# Altium project Charge-Pump-Shield.PrjPcb
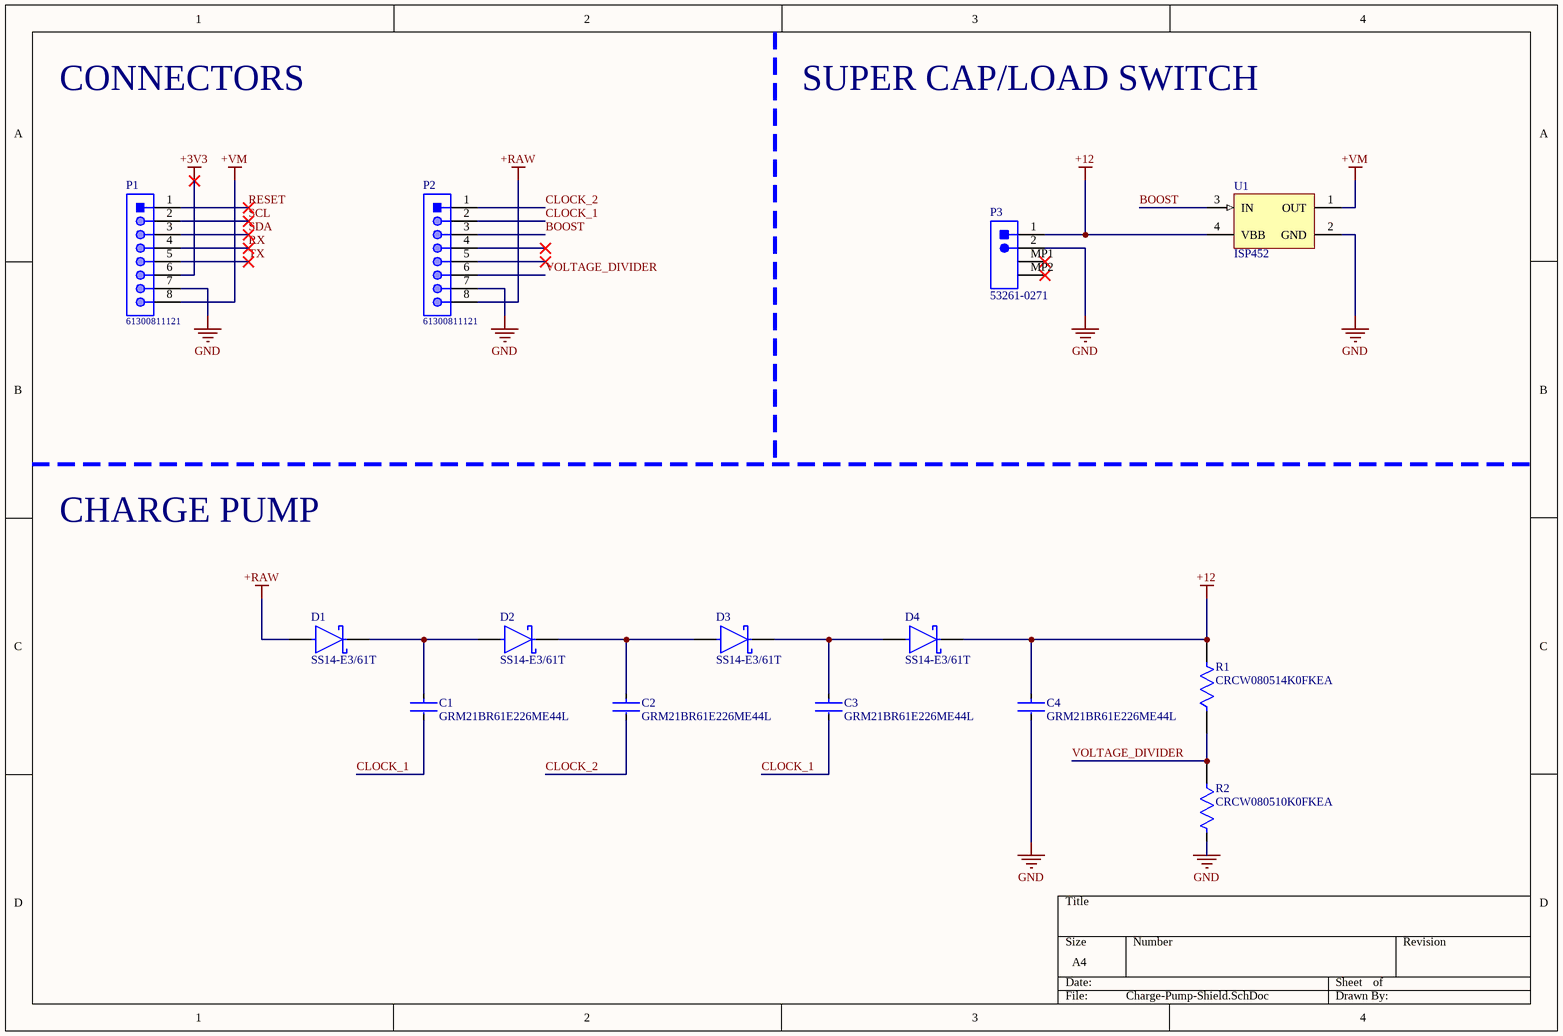
[diagram p0: Charge-Pump-Shield.SchDoc]
1 sheet, 14 parts. Net scope: global (net labels, ports and power ports of the same name join across sheets).
Board file: Charge-Pump-Shield.PcbDoc

## Sheet Charge-Pump-Shield.SchDoc: Charge Pump Shield
size A4; Author: Denil Poudel; SheetNumber: 1; SheetTotal: 1

### Parts
C1  GRM21BR61E226ME44L  [FP-GRM21B-0_2-e0_2_0_7-IPC_B]
C2  GRM21BR61E226ME44L  [FP-GRM21B-0_2-e0_2_0_7-IPC_B]
C3  GRM21BR61E226ME44L  [FP-GRM21B-0_2-e0_2_0_7-IPC_B]
C4  GRM21BR61E226ME44L  [FP-GRM21B-0_2-e0_2_0_7-IPC_B]
D1  SS14-E3/61T  [FP-95400-MFG]
D2  SS14-E3/61T  [FP-95400-MFG]
D3  SS14-E3/61T  [FP-95400-MFG]
D4  SS14-E3/61T  [FP-95400-MFG]
P1  61300811121  [61300811121]
P2  61300811121  [61300811121]
P3  53261-0271  [MOLX-53261-0271_V]
R1  CRCW080514K0FKEA  [FP-CRCW0805-e3-MFG]
R2  CRCW080510K0FKEA  [FP-CRCW0805-e3-IPC_A]
U1  ISP452  [INF-SOT223_L]

### Nets
+3V3: P1.6
+12: C4.1 D4.1(C) P3.1 R1.2 U1.4(VBB)
+RAW: D1.2(A) P2.8
+VM: P1.8 U1.1(OUT)
GND: C4.2 P1.7 P2.7 P3.2 R2.2 U1.2(GND)
BOOST: P2.3 U1.3(IN)
CLOCK_1: C1.2 C3.2 P2.2
CLOCK_2: C2.2 P2.1
RESET: P1.1
RX: P1.4
SCL: P1.2
SDA: P1.3
TX: P1.5
VOLTAGE_DIVIDER: P2.6 R1.1 R2.1
NetC1_1: C1.1 D1.1(C) D2.2(A)
NetC2_1: C2.1 D2.1(C) D3.2(A)
NetC3_1: C3.1 D3.1(C) D4.2(A)

Not connected (* = marked no-connect by the designer): P2 4* 5*; P3 MP1* MP2*

### Notes on the sheet
- CONNECTORS
- SUPER CAP/LOAD SWITCH
- CHARGE PUMP

### Library data of the parts
C1-C4 = CMP-2007-03222-3: Chip Multilayer Ceramic Capacitors for General Purpose, 0805, 22uF, X5R, 15%, 20%, 25V; Case/Package: 0805; Depth: 1.25mm; Resistor Type: Ceramic; Voltage Rating: 25V; Lead Free: Lead Free; Voltage Rating (DC): 25V; Case Code (Metric): 2012; Thickness: 0.057inch; REACH SVHC: No SVHC; Material: Ceramic; Tolerance: 20%; Length: 2mm; Capacitance: 22uF; Case Code (Imperial): 0805; Max Operating Temperature: 85°C; Termination: SMD/SMT; Weight: 0.000335oz; Dielectric: X5R; Packaging: Tape and Reel; Voltage: 25V; Package Quantity: 3000; Height: 1.25mm; Mount: Surface Mount; Width: 1.25mm; Min Operating Temperature: -55°C
D1-D4 = CMP-02539-000035-1: DIODE SCHOTTKY 40V 1A DO214AC; Manufacturer: Vishay; Peak Reverse Current: 0.2mA; Standoff Height: 0mm; Max Junction Temp: +150°C; Max Surge Forward Current: 40A; RoHS: TRUE; Digikey Description: DIODE SCHOTTKY 40V 1A DO214AC; Category: Diode; Device Class L3: Schottky Diodes; Temperature Range High: +150°C; Automotive: No; Temperature: -65°C to +150°C; Device Class L2: Diodes; Forward Current: 1A; Temperature Range Low: -65°C; Footprint Url: http://www.vishay.com/docs/95400/sma.pdf; Octopart: https://octopart.com/ss14-e3%2F61t-vishay-39552847; Package: 95400; Max Repetitive Reverse Voltage: 40V; ComponentLink2Description: Datasheet; ComponentLink2URL: http://www.vishay.com/docs/88746/ss12.pdf; Lead Free: Yes; Height: 2.29mm; Mouser Description: SS14 Series 40 V 1 A Surface Mount Schottky Barrier Rectifier - DO-214AC (SMA); Manufacturer Part Number: SS14-E3/61T; Device Class L1: Discrete Semiconductors
P1 P2 = CMP-1502-01076-1: THT Vertical Pin Header WR-PHD, Pitch 2.54 mm, Single Row, 8 pins; Manufacturer: Wurth Elektronik; Rated Current: 3A; Pin Number: 8; Working Voltage: 250VAC; Gender: Male; Contact Resistance: 20mOhm; Pitch: 2.54mm; Withstanding Voltage: 500VAC; Publisher: WurthElektronik; Operating Temperature: -40to105degC; Orientation: Vertical; Row Number: Single; Part Number: 61300811121; Package Reference: 61300811121; Mounting Technology: THT; Packaging: Bag; Manufacturer URL: http://www.we-online.de; Datasheet URL: https://katalog.we-online.de/em/datasheet/6130xx11121.pdf
P3 = CMP-2000-05633-1: PicoBlade(TM) Header, Right Angle, -40 to 85 degC, 2-Pin SMD, RoHS, Tape and Reel; Current - Max: 1A; Brand: Molex; Voltage Rating: 125V; Number of Positions: 2; Pitch: 1.25mm; Package Version: Rev. H, 11/2014; Factory Pack Quantity: 1000; Datasheet URL: http://www.molex.com/webdocs/datasheets/pdf/en-us/0532610271_PCB_HEADERS.pdf; Datasheet Version: 03/2016; Housing Material: Thermoplastic; RoHS: Details; Product Type: Headers; Number of Rows: 1; Termination Style: SMD; Mounting Technology: SurfaceMount; Number of Positions / Contacts: 2; Package URL: http://www.molex.com/pdm_docs/sd/532610271_sd.pdf; Mounting Angle: Right; Mounting Style: SMD/SMT; Manufacturer: Molex; Product Category: 1.25mmConnectors; Tradename: PicoBlade; Voltage - Max: 125V; Manufacturer URL: http://www.molex.com/; Series: 53261; Package Description: 2-Leads Header, Pitch 1.25 mm, Mated Height 3.4 mm; Package Reference: 53261-0271; Current Rating: 1A; Contact Plating: Tin; Contact Material: PhosphorBronze; Type: Shrouded; Packaging: Reel
R1 = CMP-2001-04956-2: RES Thick Film, 14kΩ, 1%, 0.125W, 100ppm/°C, 0805; Voltage Rating: 150V; Max Power Dissipation: 125mW; Resistance: 14kR; Temperature Coefficient: 100ppm/°C; Radiation Hardening: No; Number of Terminations: 2; Lead Free: Lead Free; Depth: 1.25mm; Height: 0.45mm; Case Code (Imperial): 0805; Packaging: Tape and Reel; Termination: SMD/SMT; Military Standard: Not; Length: 2mm; Working Voltage: 150V; Contact Plating: Tin; Power Rating: 125mW; Case/Package: 0805; Case Code (Metric): 2012; Weight: 0.000194oz; Features: Automotive AEC-Q200; Width: 1.25mm; Package Quantity: 10; Voltage Rating (DC): 150V; Mount: Surface Mount; Tolerance: 1%; Composition: Thick Film; Min Operating Temperature: -55°C; Max Operating Temperature: 155°C; Number of Pins: 2
R2 = CMP-2001-04908-2: RES Thick Film, 10kΩ, 1%, 0.125W, 100ppm/°C, 0805; Resistance: 10kR; Voltage Rating (DC): 150V; Power Rating: 125mW; Weight: 0.000194oz; Package Quantity: 5000; Military Standard: Not; Max Operating Temperature: 155°C; Temperature Coefficient: 100ppm/°C; Contact Plating: Tin; Width: 1.25mm; Height: 0.45mm; Radiation Hardening: No; Tolerance: 1%; Min Operating Temperature: -55°C; Voltage Rating: 150V; Length: 2mm; Depth: 1.25mm; Termination: SMD/SMT; Packaging: Tape and Reel; Case/Package: 0805; Case Code (Metric): 2012; Lead Free: Lead Free; Case Code (Imperial): 0805; Composition: Thick Film
U1 = CMP-1095-00141-1: Smart Power High-Side-Switch for Industrial Applications, 5 to 34 V Operating, -30 to 85 degC, SOT223, Reel, Green; Manufacturer: Infineon; Green: TRUE; IL (nom)min - all channels active: 0.7Â A; Channels: 1; IL (nom)min - one channel active: 0.8Â A; Operating Voltage Range (min): 5 V; Ptot (max): 1.8Â W; toff (max): 150 us; RON (max) @ Tj max: 400 mOhm; ton (max): 100 us; IL (SCp): 1.5Â A; Operating Voltage Range (max): 34 V; RON @ 25 degC: 200 mOhm (max); ComponentLink3Description: Package Specification; Mounting Technology: Surface Mount; ComponentLink2Description: Datasheet; PartNumber: ISP452; Packing: Reel; Load Current (typ): 0.7Â A; PackageDescription: 4-Pin Small Outline Transistor Package, 6.5 x 3.5 mm Body, 2.3 mm Pitch; ComponentLink3URL: http://www.infineon.com/dgdl/SOT223-Package_Overview.pdf?folderId=db3a30431936bc4b0119530470b03c3d&fileId=db3a30431936bc4b0119531d40b93c5c; ComponentLink1Description: Manufacturer URL; ComponentLink1URL: http://www.infineon.com/; ComponentLink2URL: http://www.infineon.com/dgdl/ISP452_20060301.pdf?folderId=db3a304412b407950112b408e8c90004&fileId=db3a304412b407950112b42957ef40c3; PackageReference: SOT223; IL (SC): 1.5Â A; PackageVersion: Apr-08